# Altium schematic sheet Power.SchDoc: POWER
size A3
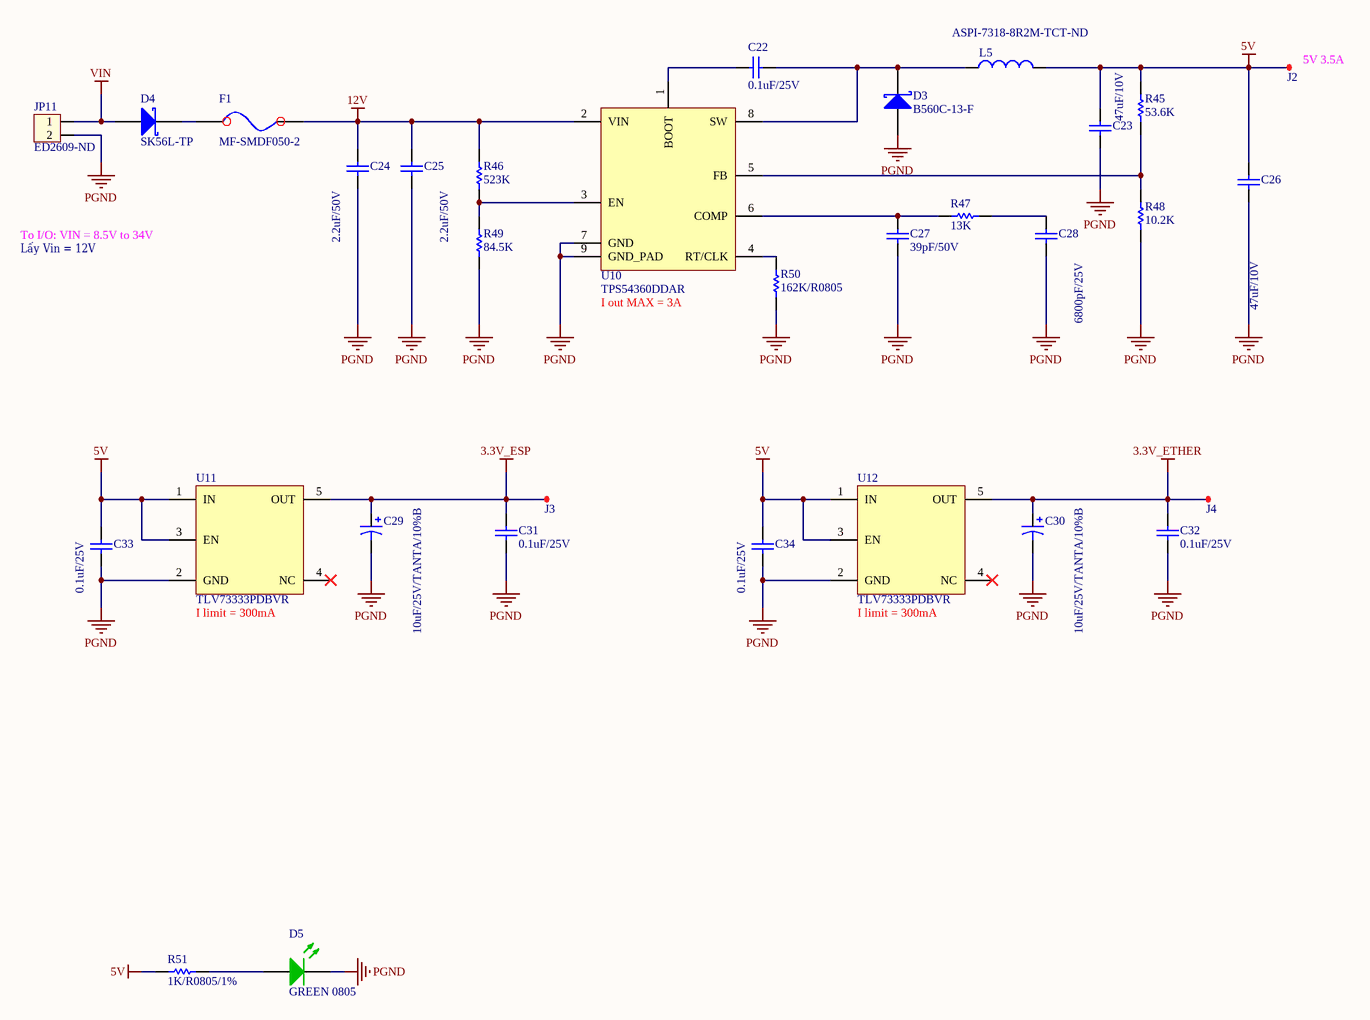
[diagram p0: Power.SchDoc]

## Parts
C22  0.1uF/25V  [CAP_CERA_C2012(CC0805INCH)]
C23  47uF/10V  [CAP_CERA_C2012(CC0805INCH)]
C24  2.2uF/50V  [CAP_CERA_C2012(CC0805INCH)]
C25  2.2uF/50V  [CAP_CERA_C2012(CC0805INCH)]
C26  47uF/10V  [CAP_CERA_C2012(CC0805INCH)]
C27  39pF/50V  [CAP_CERA_C2012(CC0805INCH)]
C28  6800pF/25V  [CAP_CERA_C2012(CC0805INCH)]
C29  10uF/25V/TANTA/10%B  [CAP TANT CASE B SMD]
C30  10uF/25V/TANTA/10%B  [CAP TANT CASE B SMD]
C31  0.1uF/25V  [CAP_CERA_C2012(CC0805INCH)]
C32  0.1uF/25V  [CAP_CERA_C2012(CC0805INCH)]
C33  0.1uF/25V  [CAP_CERA_C2012(CC0805INCH)]
C34  0.1uF/25V  [CAP_CERA_C2012(CC0805INCH)]
D3  B560C-13-F  [2# B560C]
D4  SK56L-TP  [30# SK56L-TPMSCT-ND]
D5  GREEN 0805  [Led 0805G]
F1  MF-SMDF050-2  [13# MF-SMDF050]
J2  TEST POINT  [TEST POINT 1mm]  (value not drawn)
J3  TEST POINT  [TEST POINT 1mm]  (value not drawn)
J4  TEST POINT  [TEST POINT 1mm]  (value not drawn)
JP11  ED2609-ND  [DOMINO_OSTTC_2P]
L5  ASPI-7318-8R2M-TCT-ND  [ASPI-7318-8R2M-TCT-ND]
R45  53.6K  [Res 0805 SMD]
R46  523K  [Res 0805 SMD]
R47  13K  [Res 0805 SMD]
R48  10.2K  [Res 0805 SMD]
R49  84.5K  [Res 0805 SMD]
R50  162K/R0805  [Res 0805 SMD]
R51  1K/R0805/1%  [Res 0805 SMD]
U10  TPS54360DDAR  [21# TPS54360]
U11  TLV73333PDBVR  [20# TLV73333PDBVR - SOT23-65]
U12  TLV73333PDBVR  [20# TLV73333PDBVR - SOT23-65]

## Nets
3.3V_ESP: C29.1 C31.2 J3.1(TP) U11.5(OUT)
3.3V_ETHER: C30.1 C32.2 J4.1(TP) U12.5(OUT)
5V: C23.2 C26.2 C33.2 C34.2 J2.1(TP) L5.2 R45.2 R51.1 U11.1(IN) U11.3(EN) U12.1(IN) U12.3(EN)
12V: C24.2 C25.2 F1.2(OUT) R46.2 U10.2(VIN)
PGND: C23.1 C24.1 C25.1 C26.1 C27.1 C28.1 C29.2 C30.2 C31.1 C32.1 C33.1 C34.1 D3.1(A) D5.2(K) JP11.2 R48.1 R49.1 R50.2 U10.7(GND) U10.9(GND_PAD) U11.2(GND) U12.2(GND)
VIN: D4.1(A) JP11.1
NetC22_1: C22.1 D3.2(K) L5.1 U10.8(SW)
NetC22_2: C22.2 U10.1(BOOT)
NetC27_2: C27.2 R47.2 U10.6(COMP)
NetC28_2: C28.2 R47.1
NetD4_2: D4.2(K) F1.1(IN)
NetD5_1: D5.1(A) R51.2
NetR45_1: R45.1 R48.2 U10.5(FB)
NetR46_1: R46.1 R49.2 U10.3(EN)
NetR50_1: R50.1 U10.4(RT/CLK)

Not connected (* = marked no-connect by the designer): U11 4(NC)*; U12 4(NC)*

## Notes on the sheet
- (near J2) 5V 3.5A
- To I/O: VIN = 8.5V to 34V
- Lấy Vin = 12V
- (near U10) I out MAX = 3A
- (near U11) I limit = 300mA
- (near U12) I limit = 300mA
- Title
- Size:
- Date:
- A3
- Number:
- Time:
- Revision:
- Sheet
- of
- File:

## Library data of the parts
C22 C31-C34 = 0.1uF/50V/C0603/10%: 0.1µF ±10% 25V Ceramic Capacitor X7R 0805 (2012 Metric); Manufacturer: AVX Corporation; ComponentLink1URL: http://www.murata.com/~/media/webrenewal/support/library/catalog/products/capacitor/mlcc/c02e.ashx; ComponentLink1Description: http://www.murata.com/~/media/webrenewal/support/library/catalog/products/capacitor/mlcc/c02e.ashx; Digikey: 478-3755-1-ND
C23 C26 = 0.1uF/50V/C0603/10%: 47µF ±20% 10V Ceramic Capacitor X5R 0805 (2012 Metric); Manufacturer: Murata; ComponentLink1URL: http://www.murata.com/~/media/webrenewal/support/library/catalog/products/capacitor/mlcc/c02e.ashx; ComponentLink1Description: http://www.murata.com/~/media/webrenewal/support/library/catalog/products/capacitor/mlcc/c02e.ashx; Digikey: 490-9961-1-ND
C24 C25 = 1uF/50V/C0603/10%: 2.2µF ±10% 50V Ceramic Capacitor JB 0805 (2012 Metric); Manufacturer: TDK; ComponentLink1URL: http://www.samsungsem.com/kr/support/product-search/mlcc/CL21B105KBFNNNE.jsp; ComponentLink1Description: http://www.samsungsem.com/kr/support/product-search/mlcc/CL21B105KBFNNNE.jsp; Digikey: 445-11501-1-ND
C27 = 56pF/50V/C0603/5%: 39pF ±10% 50V Ceramic Capacitor C0G, NP0 0805 (2012 Metric); Manufacturer: KEMET; Digikey: 399-9232-1-ND
C28 = 10nF/50V/C0603/10%: 6800pF ±10% 25V Ceramic Capacitor X7R 0805 (2012 Metric); Manufacturer: Wurth Electronics Inc.; ComponentLink1URL: http://www.murata.com/~/media/webrenewal/support/library/catalog/products/capacitor/mlcc/c02e.ashx; ComponentLink1Description: http://www.murata.com/~/media/webrenewal/support/library/catalog/products/capacitor/mlcc/c02e.ashx; Digikey: 732-8054-1-ND
C29 C30 = TAJB106M025RNJ: 10µF Molded Tantalum Capacitors 25V 1411 (3528 Metric) 3 Ohm; Manufacturer: KEMET; Digikey: 399-5125-1-ND
D3 = 2#B560C-13-F: DIODE SCHOTTKY 60V 5A SMC; Digikey: B560C-FDICT-ND
D4 = 30# SK56L-TP: DIODE SCHOTTKY 60V 5A DO214AB; ComponentLink1URL: http://www.mccsemi.com/up_pdf/SK52L-SK510L(DO-214AB).PDF; ComponentLink1Description: http://www.mccsemi.com/up_pdf/SK52L-SK510L(DO-214AB).PDF; Digikey: SK56L-TPMSCT-ND
D5 = LED GREEN 0603: Green 571nm LED Indication - Discrete 2V 0805 (2012 Metric); ComponentLink1URL: http://optoelectronics.liteon.com/upload/download/DS22-2000-074/S_110_LTST-C190KGKT.pdf; ComponentLink1Description: http://optoelectronics.liteon.com/upload/download/DS22-2000-074/S_110_LTST-C190KGKT.pdf; Digikey: 160-1426-1-ND
F1 = 13#MF-SMDF050-2: PTC RESET FUSE 60V 550MA 2018; Digikey: MF-SMDF050-2CT-ND
J2-J4 = PAD 1mm: TPoint
JP11 = Con2: 2 Position Wire to Board Terminal Block Horizontal with Board 0.200" (5.08mm) Through Hole; Value: Connector 2; Digikey: ED2609-ND
L5 = Inductor: 8.2µH Shielded Wirewound Inductor 4A 68 mOhm Max Nonstandard; Digikey: ASPI-7318-8R2M-TCT-ND
R45 = 15K/R0603/1%: 53.6 kOhms ±1% 0.125W, 1/8W Chip Resistor 0805 (2012 Metric) Automotive AEC-Q200 Thick Film; ComponentLink1URL: http://www.yageo.com/NewPortal/yageodocoutput?fileName=/pdf/R-Chip/PYu-RC_Group_51_RoHS_L_3.pdf; ComponentLink1Description: http://www.yageo.com/NewPortal/yageodocoutput?fileName=/pdf/R-Chip/PYu-RC_Group_51_RoHS_L_3.pdf; Digikey: 541-53.6KCCT-ND
R46 = 249K/R0805/1%: 523 kOhms ±1% 0.125W, 1/8W Chip Resistor 0805 (2012 Metric) Automotive AEC-Q200 Thick Film; ComponentLink1URL: http://www.yageo.com/documents/recent/PYu-RC_Group_51_RoHS_L_8.pdf; ComponentLink1Description: http://www.yageo.com/documents/recent/PYu-RC_Group_51_RoHS_L_8.pdf; Digikey: 541-523KCCT-ND
R47 = 15K/R0603/1%: 13 kOhms ±1% 0.125W, 1/8W Chip Resistor 0805 (2012 Metric) Automotive AEC-Q200 Thick Film; ComponentLink1URL: http://www.yageo.com/NewPortal/yageodocoutput?fileName=/pdf/R-Chip/PYu-RC_Group_51_RoHS_L_3.pdf; ComponentLink1Description: http://www.yageo.com/NewPortal/yageodocoutput?fileName=/pdf/R-Chip/PYu-RC_Group_51_RoHS_L_3.pdf; Digikey: 541-13.0KCCT-ND
R48 = 3.3K/R0603/1%: 10.2 kOhms ±1% 0.125W, 1/8W Chip Resistor 0805 (2012 Metric) Automotive AEC-Q200 Thick Film; ComponentLink1URL: http://www.yageo.com/NewPortal/yageodocoutput?fileName=/pdf/R-Chip/PYu-RC_Group_51_RoHS_L_3.pdf; ComponentLink1Description: http://www.yageo.com/NewPortal/yageodocoutput?fileName=/pdf/R-Chip/PYu-RC_Group_51_RoHS_L_3.pdf; Digikey: 541-10.0KCCT-ND
R49 = 34.8K/R0805/1%: 84.5 kOhms ±1% 0.125W, 1/8W Chip Resistor 0805 (2012 Metric) Automotive AEC-Q200 Thick Film; Digikey: 541-84.5KCCT-ND
R50 = 200K/R0603/1%: 162 kOhms ±1% 0.125W, 1/8W Chip Resistor 0805 (2012 Metric) Automotive AEC-Q200 Thick Film; ComponentLink1URL: http://www.yageo.com/documents/recent/PYu-RC_Group_51_RoHS_L_7.pdf; ComponentLink1Description: http://www.yageo.com/documents/recent/PYu-RC_Group_51_RoHS_L_7.pdf; Digikey: 541-162KCCT-ND
R51 = 200K/R0603/1%: 1 kOhms ±1% 0.125W, 1/8W Chip Resistor 0805 (2012 Metric) Automotive AEC-Q200 Thick Film; Power (Watts): 0.1W, 1/10W; RoHS: RoHS Compliant; Category: Resistors; Part Status: Active; Features: Moisture Resistant; Operating Temperature: -55°C ~ 155°C; Package / Case: 0603 (1608 Metric); Supplier Device Package: 0603; Size / Dimension: 0.063" L x 0.031" W (1.60mm x 0.80mm); Height - Seated (Max): 0.022" (0.55mm); Failure Rate: -; ComponentLink1URL: http://www.yageo.com/documents/recent/PYu-RC_Group_51_RoHS_L_7.pdf; ComponentLink1Description: http://www.yageo.com/documents/recent/PYu-RC_Group_51_RoHS_L_7.pdf; Digikey: 541-1.00KCCT-ND
U10 = 21#TPS54360DDAR: Buck, Split Rail Switching Regulator IC Positive Adjustable 0.8V 1 Output 3.5A 8-PowerSOIC (0.154", 3.90mm Width); Digikey: 296-37676-1-ND
U11 U12 = 20#TLV73333PDBVR: Linear Voltage Regulator IC Positive Fixed 1 Output 3.3V 300mA SOT-23-5; Digikey: 296-40673-1-ND